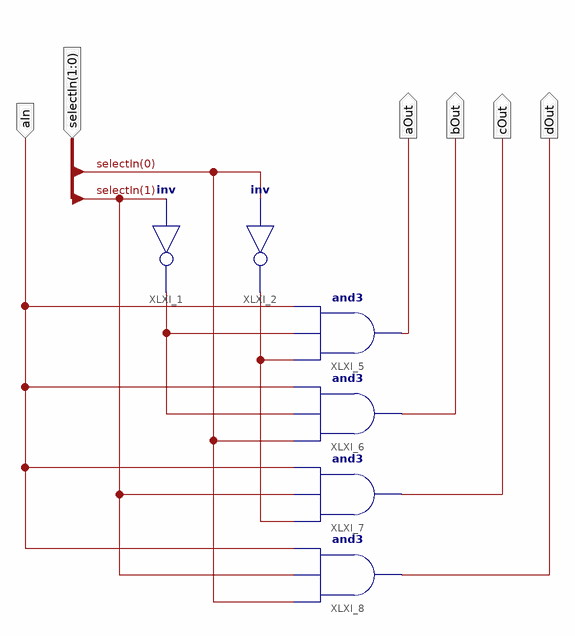
[diagram p0: schematic sheet 1]
// Xilinx ISE schematic Demux4x1.sch (spartan3e) as structural Verilog: 6 symbols, 6 ports
module Demux4x1 (
  input  aIn,
  input  [1:0] selectIn,
  output aOut,
  output bOut,
  output cOut,
  output dOut
);

  wire XLXN_14, XLXN_16;

  not XLXI_1 (XLXN_14, selectIn[1]);
  not XLXI_2 (XLXN_16, selectIn[0]);
  and XLXI_5 (aOut, XLXN_16, XLXN_14, aIn);
  and XLXI_6 (bOut, selectIn[0], XLXN_14, aIn);
  and XLXI_7 (cOut, XLXN_16, selectIn[1], aIn);
  and XLXI_8 (dOut, selectIn[0], selectIn[1], aIn);
endmodule
